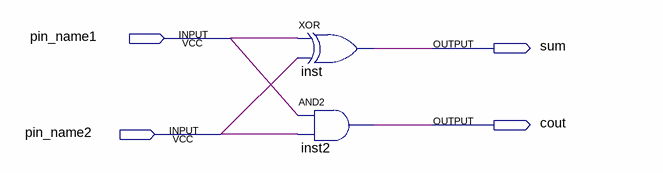
[diagram p0: schematic sheet]
// Quartus schematic HA.bdf as structural Verilog: 2 symbols, 4 pins
module HA (
  input  pin_name1,
  input  pin_name2,
  output sum,
  output cout
);

  xor inst (sum, pin_name1, pin_name2);
  and inst2 (cout, pin_name1, pin_name2);
endmodule
